# Altium schematic sheet MKI178V1.SchDoc
size A4
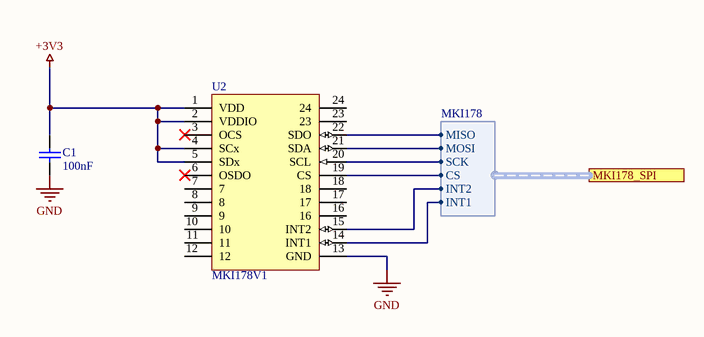
[diagram p0: MKI178V1.SchDoc]

## Parts
C1  100nF  [FP_0805_CAP_085]
U2  MKI178V1  [MKI178V1]

## Ports
MKI178_SPI (harness MKI178)

## Harnesses
MKI178: MISO, MOSI, SCK, CS, INT2, INT1

## Nets
+3V3: C1.2 U2.1(VDD) U2.2(VDDIO) U2.4(SCx) U2.5(SDx)
GND: C1.1 U2.13(GND)
NetU2_14: U2.14(INT1) ; port MKI178_SPI.INT1
NetU2_15: U2.15(INT2) ; port MKI178_SPI.INT2
NetU2_19: U2.19(CS) ; port MKI178_SPI.CS
NetU2_20: U2.20(SCL) ; port MKI178_SPI.SCK
NetU2_21: U2.21(SDA) ; port MKI178_SPI.MOSI
NetU2_22: U2.22(SDO) ; port MKI178_SPI.MISO

Not connected (* = marked no-connect by the designer): U2 3(OCS)* 6(OSDO)* 7 8 9 10 11 12 16 17 18 23 24

## Library data of the parts
C1 = 100nF_0805_CAP: Capacitor; Value: 100nF
U2 = MKI178V1: Supplier: Tanszék